# EasyEDA Pro project New Project ufcd 6024 2.eprj

# Schematic Schematic1
Board Name: Board1; Create Date: 2025-03-15; Page Name: P1; Project Name: New Project ufcd 6024 2; Schematic Name: Schematic1; Update Date: 2025-03-15; Company: EasyEDA.com; Page Size: A4; Version: V1.0
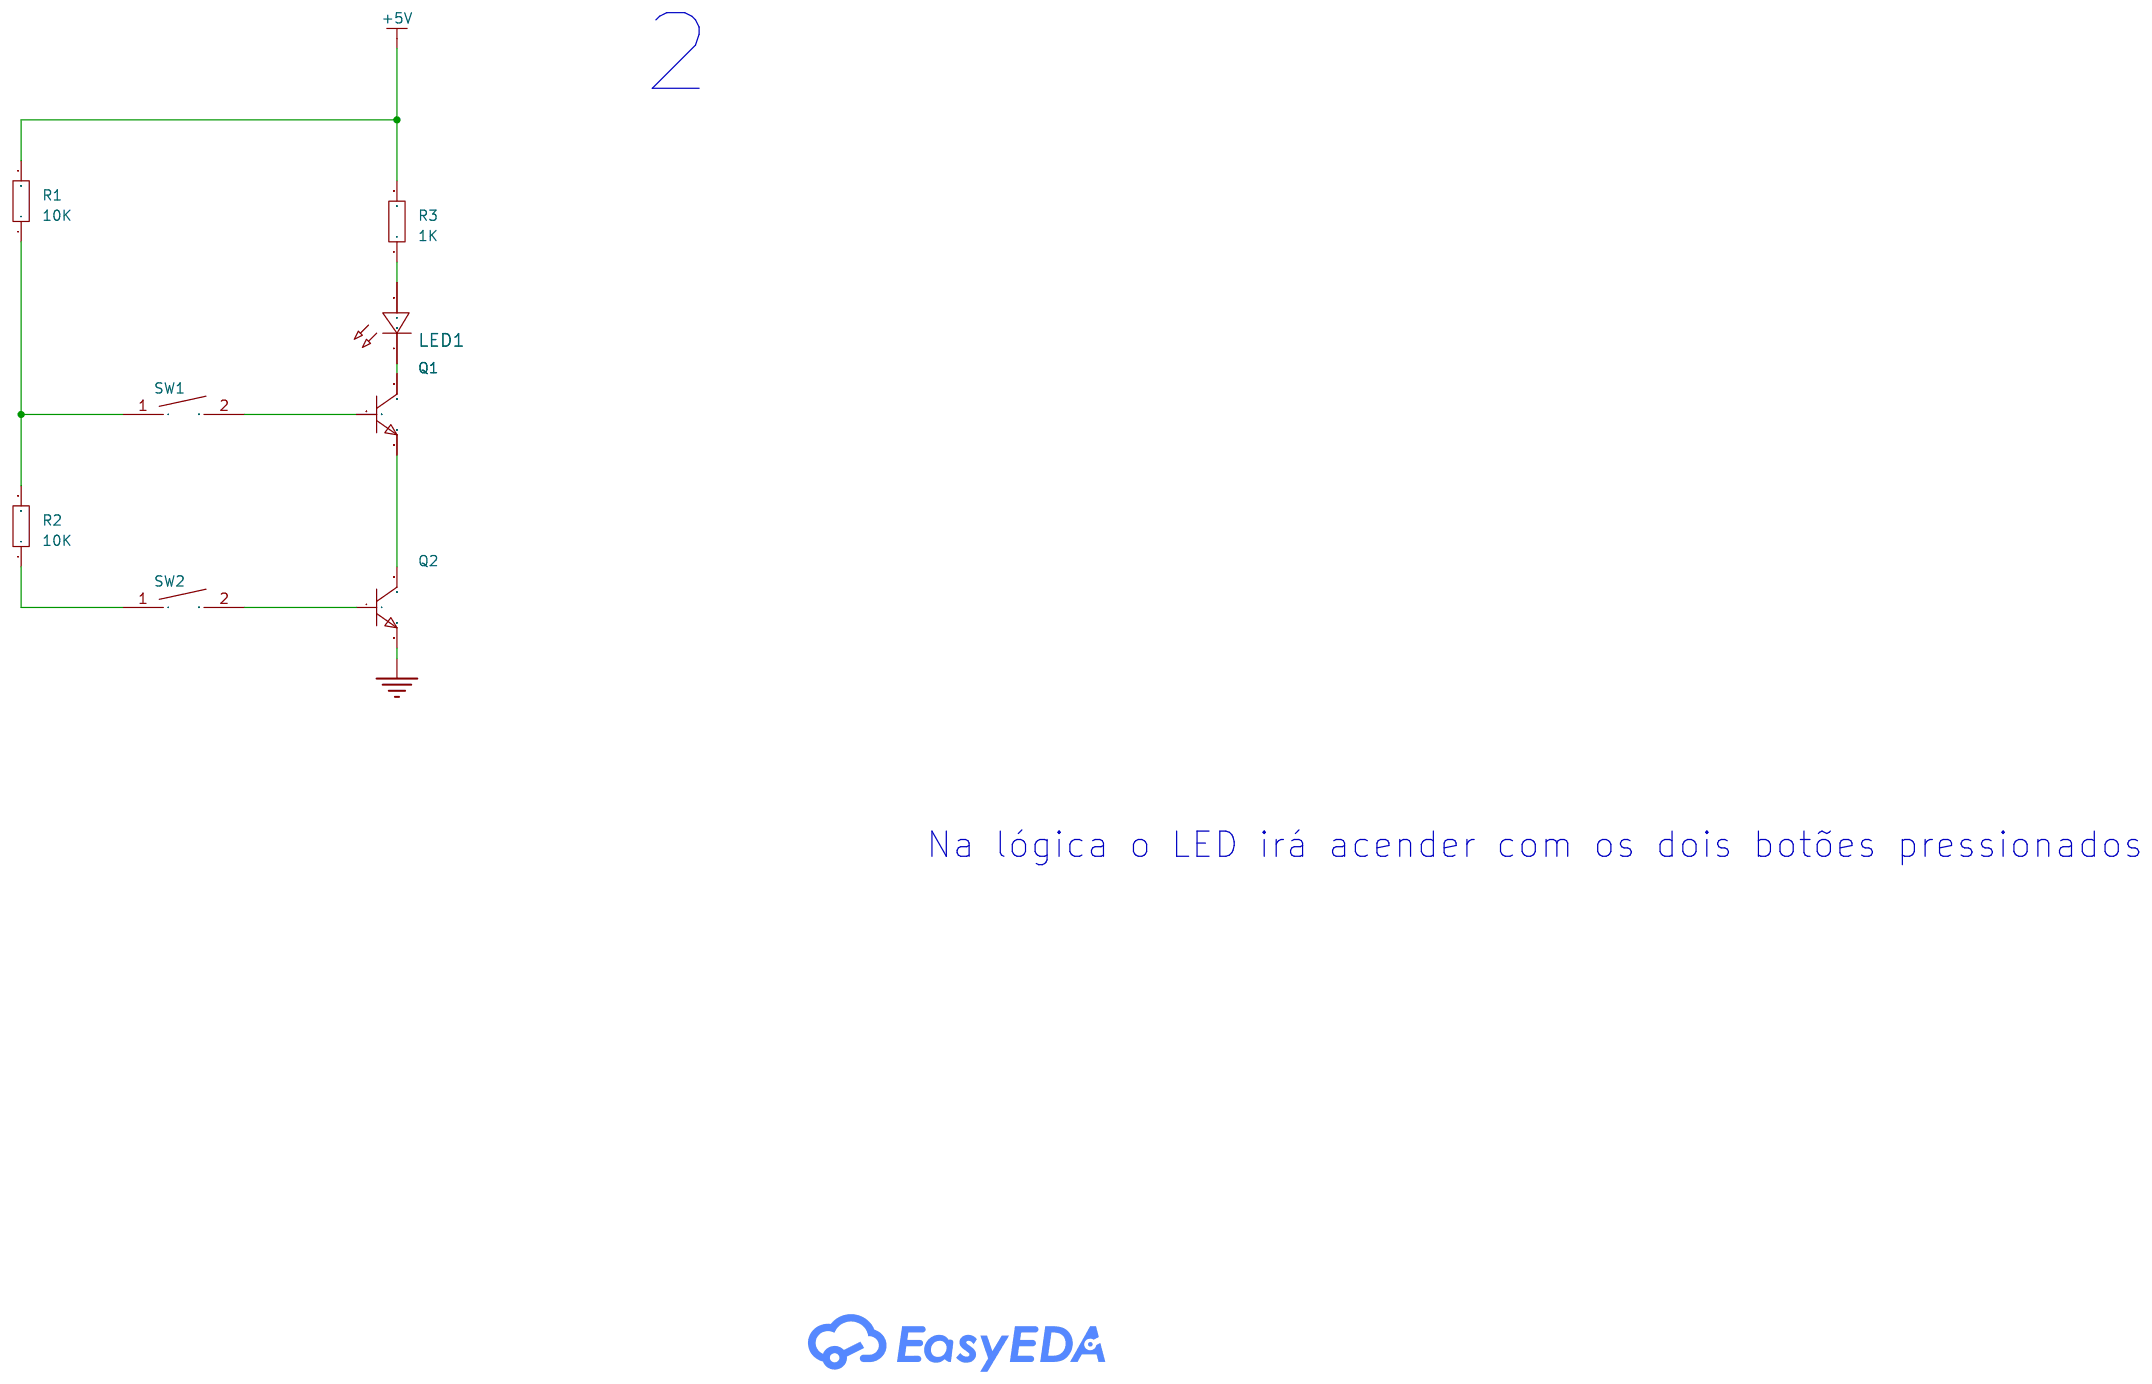
[diagram p0: schematic sheet]

## Parts
LED1  -  [LED_0603]
Q1  -  [S8050_SOT-23]
Q2  -  [S8050_SOT-23]
R1  10K  [R0603]
R2  10K  [R0603]
R3  1K  [R0603]
SW1  -  [SW-TH_P7.00_SS11-RBDWQ-R20-R]
SW2  -  [SW-TH_P7.00_SS11-RBDWQ-R20-R]

## Library data of the parts
LED1 = LED_0603-R: Supplier Footprint: 0603
Q1 Q2 = S8050_SOT_NPN: Supplier Footprint: SOT-23
R1-R3 = Res_0603: Supplier Footprint: 0603
SW1 SW2 = SS11-RBDWQ-R20-R: LCSC Part Name: 跷板开关SPST 15x21mm; Supplier Part: C309068; Manufacturer: Legion(六钧); Supplier Footprint: 插件; JLCPCB Part Class: Extended Part; Datasheet: https://atta.szlcsc.com/upload/public/pdf/source/20190108/C309068_16577DDE2F2C880B57E66CA4581D76CA.pdf; Supplier: LCSC

## Nets
+5V: R1.2 R3.2
GND: Q2.2
Net-(LED1-1): LED1.1(C) Q1.3
Net-(LED1-2): LED1.2(A) R3.1
Net-(Q1-1): Q1.1 SW1.2
Net-(Q1-2): Q1.2 Q2.3
Net-(Q2-1): Q2.1 SW2.2
Net-(R1-1): R1.1 R2.2 SW1.1
Net-(R2-1): R2.1 SW2.1

## Notes on the sheet
- 2
- Na lógica o LED irá acender com os dois botões pressionados
